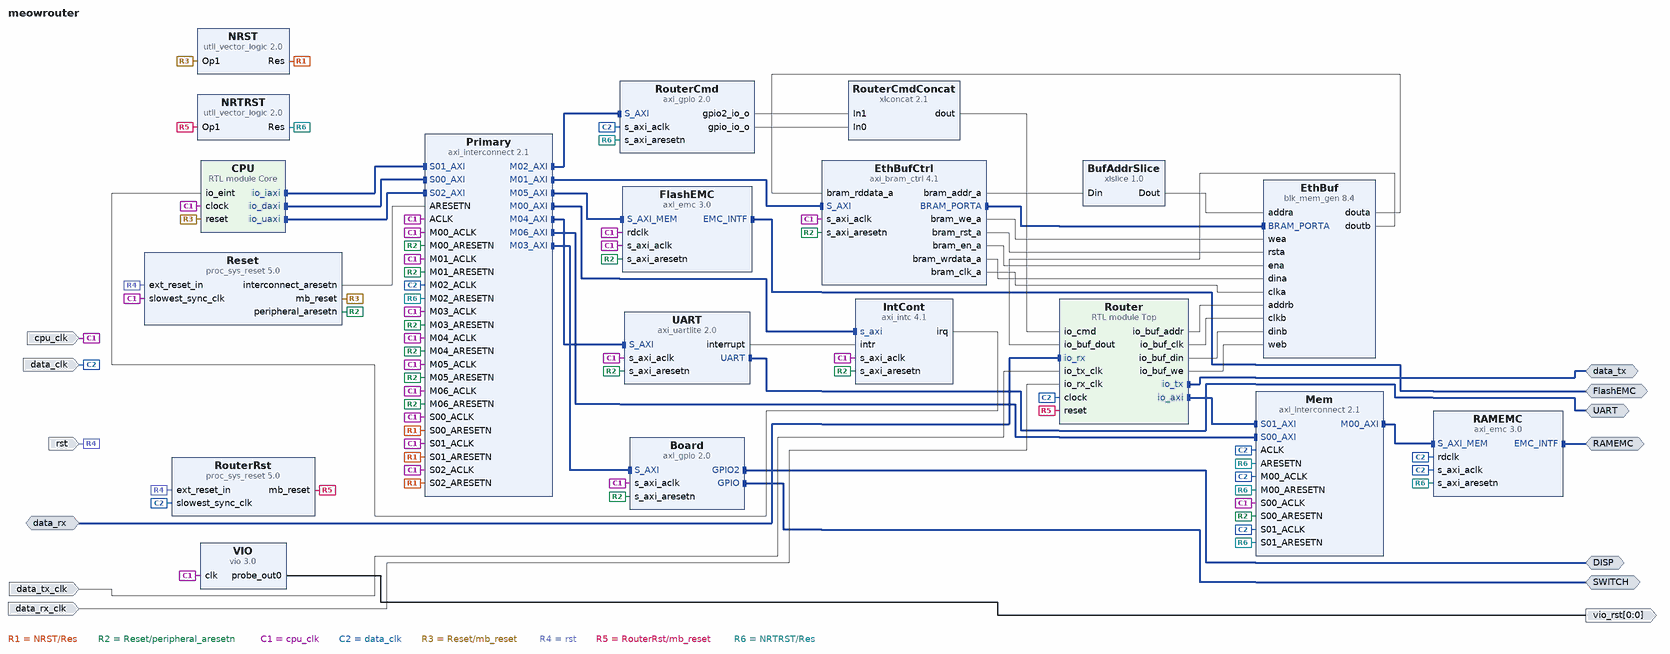
[diagram p0: block diagram of the top level]
# Vivado block design meowrouter, xc7a100tfgg676-2L, Vivado 2018.3_AR71898
create_bd_design meowrouter

create_bd_intf_port -mode Master -vlnv xilinx.com:interface:uart_rtl:1.0 UART
create_bd_intf_port -mode Slave -vlnv xilinx.com:interface:axis_rtl:1.0 data_rx
set_property -dict [list \
  CONFIG.FREQ_HZ 125000000 \
  CONFIG.HAS_TKEEP 0 \
  CONFIG.HAS_TLAST 1 \
  CONFIG.HAS_TREADY 0 \
  CONFIG.HAS_TSTRB 0 \
  CONFIG.LAYERED_METADATA undef \
  CONFIG.TDATA_NUM_BYTES 1 \
  CONFIG.TDEST_WIDTH 0 \
  CONFIG.TID_WIDTH 0 \
  CONFIG.TUSER_WIDTH 0 \
] [get_bd_intf_ports data_rx]
create_bd_intf_port -mode Master -vlnv xilinx.com:interface:axis_rtl:1.0 data_tx
set_property -dict {CONFIG.FREQ_HZ 125000000} [get_bd_intf_ports data_tx]
create_bd_intf_port -mode Master -vlnv xilinx.com:interface:gpio_rtl:1.0 DISP
create_bd_intf_port -mode Master -vlnv xilinx.com:interface:gpio_rtl:1.0 SWITCH
create_bd_intf_port -mode Master -vlnv xilinx.com:interface:emc_rtl:1.0 RAMEMC
create_bd_intf_port -mode Master -vlnv xilinx.com:interface:emc_rtl:1.0 FlashEMC
create_bd_port -dir I -type clk cpu_clk
set_property -dict {CONFIG.FREQ_HZ 70000000} [get_bd_ports cpu_clk]
create_bd_port -dir I -type rst rst
set_property -dict {CONFIG.POLARITY ACTIVE_HIGH} [get_bd_ports rst]
create_bd_port -dir I -type clk data_clk
set_property -dict {CONFIG.FREQ_HZ 125000000} [get_bd_ports data_clk]
create_bd_port -dir I -type clk data_rx_clk
set_property -dict {CONFIG.FREQ_HZ 125000000} [get_bd_ports data_rx_clk]
create_bd_port -dir I -type clk data_tx_clk
set_property -dict {CONFIG.FREQ_HZ 125000000} [get_bd_ports data_tx_clk]
create_bd_port -dir O -from 0 -to 0 vio_rst

create_bd_cell -type ip -vlnv xilinx.com:ip:blk_mem_gen:8.4 EthBuf
set_property -dict [list \
  CONFIG.Assume_Synchronous_Clk false \
  CONFIG.Byte_Size 8 \
  CONFIG.EN_SAFETY_CKT true \
  CONFIG.Enable_32bit_Address false \
  CONFIG.Enable_B Always_Enabled \
  CONFIG.Memory_Type True_Dual_Port_RAM \
  CONFIG.Port_B_Clock 100 \
  CONFIG.Port_B_Enable_Rate 100 \
  CONFIG.Port_B_Write_Rate 50 \
  CONFIG.Read_Width_A 32 \
  CONFIG.Read_Width_B 8 \
  CONFIG.Register_PortA_Output_of_Memory_Core false \
  CONFIG.Register_PortA_Output_of_Memory_Primitives false \
  CONFIG.Register_PortB_Output_of_Memory_Core false \
  CONFIG.Register_PortB_Output_of_Memory_Primitives false \
  CONFIG.Use_Byte_Write_Enable true \
  CONFIG.Use_RSTA_Pin true \
  CONFIG.Use_RSTB_Pin false \
  CONFIG.Write_Depth_A 32768 \
  CONFIG.Write_Width_A 32 \
  CONFIG.Write_Width_B 8 \
  CONFIG.use_bram_block Stand_Alone \
] [get_bd_cells EthBuf]
create_bd_cell -type ip -vlnv xilinx.com:ip:axi_bram_ctrl:4.1 EthBufCtrl
set_property -dict [list \
  CONFIG.DATA_WIDTH 32 \
  CONFIG.PROTOCOL AXI4 \
  CONFIG.READ_LATENCY 1 \
  CONFIG.SINGLE_PORT_BRAM 1 \
] [get_bd_cells EthBufCtrl]
create_bd_cell -type ip -vlnv xilinx.com:ip:util_vector_logic:2.0 NRST
set_property -dict {CONFIG.C_OPERATION not CONFIG.C_SIZE 1} [get_bd_cells NRST]
create_bd_cell -type ip -vlnv xilinx.com:ip:proc_sys_reset:5.0 Reset
create_bd_cell -type ip -vlnv xilinx.com:ip:axi_gpio:2.0 Board
set_property -dict [list \
  CONFIG.C_ALL_INPUTS 1 \
  CONFIG.C_ALL_OUTPUTS_2 1 \
  CONFIG.C_GPIO2_WIDTH 32 \
  CONFIG.C_GPIO_WIDTH 16 \
  CONFIG.C_IS_DUAL 1 \
] [get_bd_cells Board]
create_bd_cell -type ip -vlnv xilinx.com:ip:axi_emc:3.0 RAMEMC
set_property -dict [list \
  CONFIG.C_INCLUDE_DATAWIDTH_MATCHING_0 0 \
  CONFIG.C_MAX_MEM_WIDTH 64 \
  CONFIG.C_MEM0_TYPE 1 \
  CONFIG.C_MEM0_WIDTH 64 \
  CONFIG.C_MEM1_WIDTH 16 \
  CONFIG.C_NUM_BANKS_MEM 1 \
  CONFIG.C_S_AXI_MEM_DATA_WIDTH 64 \
  CONFIG.C_TAVDV_PS_MEM_0 10000 \
  CONFIG.C_TCEDV_PS_MEM_0 10000 \
  CONFIG.C_THZCE_PS_MEM_0 10000 \
  CONFIG.C_THZOE_PS_MEM_0 6500 \
] [get_bd_cells RAMEMC]
create_bd_cell -type ip -vlnv xilinx.com:ip:axi_emc:3.0 FlashEMC
set_property -dict [list \
  CONFIG.C_MEM0_TYPE 5 \
  CONFIG.C_TAVDV_PS_MEM_0 30000 \
  CONFIG.C_TCEDV_PS_MEM_0 70000 \
  CONFIG.C_THZCE_PS_MEM_0 7000 \
] [get_bd_cells FlashEMC]
create_bd_cell -type ip -vlnv xilinx.com:ip:vio:3.0 VIO
set_property -dict {CONFIG.C_NUM_PROBE_IN 0 CONFIG.C_NUM_PROBE_OUT 1} [get_bd_cells VIO]
create_bd_cell -type ip -vlnv xilinx.com:ip:axi_intc:4.1 IntCont
set_property -dict [list \
  CONFIG.C_CASCADE_MASTER 0 \
  CONFIG.C_EN_CASCADE_MODE 0 \
  CONFIG.C_HAS_CIE 1 \
  CONFIG.C_HAS_ILR 0 \
  CONFIG.C_HAS_IPR 1 \
  CONFIG.C_HAS_IVR 1 \
  CONFIG.C_HAS_SIE 1 \
  CONFIG.C_IRQ_CONNECTION 1 \
  CONFIG.C_IRQ_IS_LEVEL 1 \
  CONFIG.C_NUM_SW_INTR 0 \
  CONFIG.C_PROCESSOR_CLK_FREQ_MHZ 70 \
  CONFIG.C_S_AXI_ACLK_FREQ_MHZ 70 \
  CONFIG.Sense_of_IRQ_Level_Type Active_High \
] [get_bd_cells IntCont]
create_bd_cell -type ip -vlnv xilinx.com:ip:xlslice:1.0 BufAddrSlice
set_property -dict {CONFIG.DIN_FROM 31 CONFIG.DIN_TO 2 CONFIG.DOUT_WIDTH 30} [get_bd_cells BufAddrSlice]
create_bd_cell -type ip -vlnv xilinx.com:ip:axi_uartlite:2.0 UART
set_property -dict [list \
  CONFIG.C_BAUDRATE 57600 \
  CONFIG.C_S_AXI_ACLK_FREQ_HZ 70000000 \
  CONFIG.C_S_AXI_ACLK_FREQ_HZ_d 70 \
] [get_bd_cells UART]
create_bd_cell -type ip -vlnv xilinx.com:ip:axi_gpio:2.0 RouterCmd
set_property -dict [list \
  CONFIG.C_ALL_OUTPUTS 1 \
  CONFIG.C_ALL_OUTPUTS_2 1 \
  CONFIG.C_GPIO_WIDTH 32 \
  CONFIG.C_INTERRUPT_PRESENT 0 \
  CONFIG.C_IS_DUAL 1 \
] [get_bd_cells RouterCmd]
create_bd_cell -type ip -vlnv xilinx.com:ip:xlconcat:2.1 RouterCmdConcat
create_bd_cell -type module -reference Core CPU
create_bd_cell -type ip -vlnv xilinx.com:ip:proc_sys_reset:5.0 RouterRst
create_bd_cell -type ip -vlnv xilinx.com:ip:util_vector_logic:2.0 NRTRST
set_property -dict {CONFIG.C_OPERATION not CONFIG.C_SIZE 1} [get_bd_cells NRTRST]
create_bd_cell -type ip -vlnv xilinx.com:ip:axi_interconnect:2.1 Primary
set_property -dict [list \
  CONFIG.ENABLE_ADVANCED_OPTIONS 0 \
  CONFIG.NUM_MI 7 \
  CONFIG.NUM_SI 3 \
  CONFIG.S00_HAS_DATA_FIFO 2 \
  CONFIG.S01_HAS_DATA_FIFO 2 \
  CONFIG.S02_HAS_DATA_FIFO 2 \
  CONFIG.S03_HAS_DATA_FIFO 2 \
  CONFIG.STRATEGY 2 \
] [get_bd_cells Primary]
create_bd_cell -type ip -vlnv xilinx.com:ip:axi_interconnect:2.1 Mem
set_property -dict [list \
  CONFIG.NUM_MI 1 \
  CONFIG.NUM_SI 2 \
  CONFIG.S00_HAS_DATA_FIFO 2 \
  CONFIG.S01_HAS_DATA_FIFO 2 \
  CONFIG.STRATEGY 2 \
] [get_bd_cells Mem]
create_bd_cell -type module -reference Top Router

# ---- connections ----

connect_bd_intf_net [get_bd_intf_ports FlashEMC] [get_bd_intf_pins FlashEMC/EMC_INTF]
connect_bd_intf_net -intf_net axi_gpio_0_GPIO2 [get_bd_intf_ports DISP] [get_bd_intf_pins Board/GPIO2]
connect_bd_intf_net -intf_net axi_interconnect_0_M01_AXI [get_bd_intf_pins Primary/M01_AXI] [get_bd_intf_pins EthBufCtrl/S_AXI]
connect_bd_intf_net -intf_net axi_interconnect_0_M02_AXI [get_bd_intf_pins Primary/M02_AXI] [get_bd_intf_pins RouterCmd/S_AXI]
connect_bd_intf_net -intf_net axi_interconnect_0_M00_AXI1 [get_bd_intf_pins RAMEMC/S_AXI_MEM] [get_bd_intf_pins Mem/M00_AXI]
connect_bd_intf_net [get_bd_intf_pins Primary/S01_AXI] [get_bd_intf_pins CPU/io_iaxi]
connect_bd_intf_net [get_bd_intf_pins EthBufCtrl/BRAM_PORTA] [get_bd_intf_pins EthBuf/BRAM_PORTA]
connect_bd_intf_net -intf_net axi_uartlite_0_UART [get_bd_intf_ports UART] [get_bd_intf_pins UART/UART]
connect_bd_intf_net [get_bd_intf_ports data_tx] [get_bd_intf_pins Router/io_tx]
connect_bd_intf_net [get_bd_intf_ports data_rx] [get_bd_intf_pins Router/io_rx]
connect_bd_intf_net [get_bd_intf_ports RAMEMC] [get_bd_intf_pins RAMEMC/EMC_INTF]
connect_bd_intf_net [get_bd_intf_ports SWITCH] [get_bd_intf_pins Board/GPIO]
connect_bd_intf_net -intf_net axi_interconnect_0_M04_AXI [get_bd_intf_pins Primary/M04_AXI] [get_bd_intf_pins UART/S_AXI]
connect_bd_intf_net -intf_net axi_interconnect_0_M00_AXI [get_bd_intf_pins Primary/M00_AXI] [get_bd_intf_pins IntCont/s_axi]
connect_bd_intf_net [get_bd_intf_pins Primary/S00_AXI] [get_bd_intf_pins CPU/io_daxi]
connect_bd_intf_net [get_bd_intf_pins Mem/S00_AXI] [get_bd_intf_pins Primary/M06_AXI]
connect_bd_intf_net -intf_net axi_interconnect_0_M03_AXI [get_bd_intf_pins Primary/M03_AXI] [get_bd_intf_pins Board/S_AXI]
connect_bd_intf_net [get_bd_intf_pins Router/io_axi] [get_bd_intf_pins Mem/S01_AXI]
connect_bd_intf_net -intf_net axi_interconnect_0_M05_AXI [get_bd_intf_pins Primary/M05_AXI] [get_bd_intf_pins FlashEMC/S_AXI_MEM]
connect_bd_intf_net [get_bd_intf_pins Primary/S02_AXI] [get_bd_intf_pins CPU/io_uaxi]
connect_bd_net -net util_vector_logic_0_Res [get_bd_pins NRST/Res] \
  [get_bd_pins Primary/S00_ARESETN] [get_bd_pins Primary/S01_ARESETN] [get_bd_pins Primary/S02_ARESETN]
connect_bd_net -net proc_sys_reset_0_peripheral_aresetn [get_bd_pins Reset/peripheral_aresetn] \
  [get_bd_pins Board/s_axi_aresetn] [get_bd_pins EthBufCtrl/s_axi_aresetn] [get_bd_pins FlashEMC/s_axi_aresetn] \
  [get_bd_pins IntCont/s_axi_aresetn] [get_bd_pins UART/s_axi_aresetn] [get_bd_pins Primary/M00_ARESETN] \
  [get_bd_pins Primary/M03_ARESETN] [get_bd_pins Primary/M04_ARESETN] [get_bd_pins Primary/M05_ARESETN] \
  [get_bd_pins Primary/M01_ARESETN] [get_bd_pins Primary/M06_ARESETN] [get_bd_pins Mem/S00_ARESETN]
connect_bd_net -net clk_1 [get_bd_ports cpu_clk] \
  [get_bd_pins Reset/slowest_sync_clk] [get_bd_pins EthBufCtrl/s_axi_aclk] [get_bd_pins Board/s_axi_aclk] \
  [get_bd_pins FlashEMC/s_axi_aclk] [get_bd_pins FlashEMC/rdclk] [get_bd_pins VIO/clk] [get_bd_pins IntCont/s_axi_aclk] \
  [get_bd_pins UART/s_axi_aclk] [get_bd_pins CPU/clock] [get_bd_pins Primary/M05_ACLK] [get_bd_pins Primary/M04_ACLK] \
  [get_bd_pins Primary/M03_ACLK] [get_bd_pins Primary/M01_ACLK] [get_bd_pins Primary/M00_ACLK] [get_bd_pins Primary/S00_ACLK] \
  [get_bd_pins Primary/S01_ACLK] [get_bd_pins Primary/S02_ACLK] [get_bd_pins Primary/ACLK] [get_bd_pins Primary/M06_ACLK] \
  [get_bd_pins Mem/S00_ACLK]
connect_bd_net -net vio_0_probe_out0 [get_bd_pins VIO/probe_out0] [get_bd_ports vio_rst]
connect_bd_net -net tx_clk_1 [get_bd_ports data_tx_clk] [get_bd_pins Router/io_tx_clk]
connect_bd_net -net rx_clk_1 [get_bd_ports data_rx_clk] [get_bd_pins Router/io_rx_clk]
connect_bd_net -net rtclk_1 [get_bd_ports data_clk] \
  [get_bd_pins RouterCmd/s_axi_aclk] [get_bd_pins RouterRst/slowest_sync_clk] [get_bd_pins Primary/M02_ACLK] \
  [get_bd_pins RAMEMC/s_axi_aclk] [get_bd_pins RAMEMC/rdclk] [get_bd_pins Mem/M00_ACLK] [get_bd_pins Mem/S01_ACLK] \
  [get_bd_pins Mem/ACLK] [get_bd_pins Router/clock]
connect_bd_net -net proc_sys_reset_0_mb_reset [get_bd_pins Reset/mb_reset] [get_bd_pins NRST/Op1] [get_bd_pins CPU/reset]
connect_bd_net -net axi_intc_0_irq [get_bd_pins IntCont/irq] [get_bd_pins CPU/io_eint]
connect_bd_net [get_bd_pins Router/io_buf_addr] [get_bd_pins EthBuf/addrb]
connect_bd_net [get_bd_pins Router/io_buf_clk] [get_bd_pins EthBuf/clkb]
connect_bd_net [get_bd_pins Router/io_buf_din] [get_bd_pins EthBuf/dinb]
connect_bd_net [get_bd_pins EthBuf/doutb] [get_bd_pins Router/io_buf_dout]
connect_bd_net [get_bd_pins Router/io_buf_we] [get_bd_pins EthBuf/web]
connect_bd_net [get_bd_pins EthBufCtrl/bram_addr_a] [get_bd_pins BufAddrSlice/Din]
connect_bd_net -net xlslice_0_Dout [get_bd_pins BufAddrSlice/Dout] [get_bd_pins EthBuf/addra]
connect_bd_net [get_bd_pins EthBufCtrl/bram_we_a] [get_bd_pins EthBuf/wea]
connect_bd_net [get_bd_pins EthBufCtrl/bram_rst_a] [get_bd_pins EthBuf/rsta]
connect_bd_net [get_bd_pins EthBufCtrl/bram_en_a] [get_bd_pins EthBuf/ena]
connect_bd_net [get_bd_pins EthBuf/douta] [get_bd_pins EthBufCtrl/bram_rddata_a]
connect_bd_net [get_bd_pins EthBufCtrl/bram_wrdata_a] [get_bd_pins EthBuf/dina]
connect_bd_net [get_bd_pins EthBufCtrl/bram_clk_a] [get_bd_pins EthBuf/clka]
connect_bd_net -net axi_uartlite_0_interrupt [get_bd_pins UART/interrupt] [get_bd_pins IntCont/intr]
connect_bd_net -net xlconcat_0_dout [get_bd_pins RouterCmdConcat/dout] [get_bd_pins Router/io_cmd]
connect_bd_net [get_bd_pins RouterCmd/gpio2_io_o] [get_bd_pins RouterCmdConcat/In1]
connect_bd_net [get_bd_pins RouterCmd/gpio_io_o] [get_bd_pins RouterCmdConcat/In0]
connect_bd_net [get_bd_ports rst] [get_bd_pins Reset/ext_reset_in] [get_bd_pins RouterRst/ext_reset_in]
connect_bd_net [get_bd_pins RouterRst/mb_reset] [get_bd_pins NRTRST/Op1] [get_bd_pins Router/reset]
connect_bd_net -net S03_ARESETN_1 [get_bd_pins NRTRST/Res] \
  [get_bd_pins RouterCmd/s_axi_aresetn] [get_bd_pins Primary/M02_ARESETN] [get_bd_pins RAMEMC/s_axi_aresetn] \
  [get_bd_pins Mem/M00_ARESETN] [get_bd_pins Mem/S01_ARESETN] [get_bd_pins Mem/ARESETN]
connect_bd_net -net ARESETN_1 [get_bd_pins Reset/interconnect_aresetn] [get_bd_pins Primary/ARESETN]

# ---- address map ----
assign_bd_address -offset 0x000000000000 -range 8M -target_address_space [get_bd_addr_spaces CPU/io_daxi] [get_bd_addr_segs RAMEMC/S_AXI_MEM/Mem0]
assign_bd_address -offset 0xF00000000000 -range 64K -target_address_space [get_bd_addr_spaces CPU/io_daxi] [get_bd_addr_segs IntCont/S_AXI/Reg]
assign_bd_address -offset 0xFFFF00000000 -range 1M -target_address_space [get_bd_addr_spaces CPU/io_daxi] [get_bd_addr_segs UART/S_AXI/Reg]
assign_bd_address -offset 0xFFFF10000000 -range 1M -target_address_space [get_bd_addr_spaces CPU/io_daxi] [get_bd_addr_segs Board/S_AXI/Reg]
assign_bd_address -offset 0xFFFF20000000 -range 8M -target_address_space [get_bd_addr_spaces CPU/io_daxi] [get_bd_addr_segs FlashEMC/S_AXI_MEM/Mem0]
assign_bd_address -offset 0xFFFF30000000 -range 1M -target_address_space [get_bd_addr_spaces CPU/io_daxi] [get_bd_addr_segs EthBufCtrl/S_AXI/Mem0]
assign_bd_address -offset 0xFFFF40000000 -range 1M -target_address_space [get_bd_addr_spaces CPU/io_daxi] [get_bd_addr_segs RouterCmd/S_AXI/Reg]
assign_bd_address -offset 0x000000000000 -range 8M -target_address_space [get_bd_addr_spaces CPU/io_iaxi] [get_bd_addr_segs RAMEMC/S_AXI_MEM/Mem0]
assign_bd_address -offset 0xF00000000000 -range 64K -target_address_space [get_bd_addr_spaces CPU/io_iaxi] [get_bd_addr_segs IntCont/S_AXI/Reg]
assign_bd_address -offset 0xFFFF00000000 -range 1M -target_address_space [get_bd_addr_spaces CPU/io_iaxi] [get_bd_addr_segs UART/S_AXI/Reg]
assign_bd_address -offset 0xFFFF10000000 -range 1M -target_address_space [get_bd_addr_spaces CPU/io_iaxi] [get_bd_addr_segs Board/S_AXI/Reg]
assign_bd_address -offset 0xFFFF20000000 -range 8M -target_address_space [get_bd_addr_spaces CPU/io_iaxi] [get_bd_addr_segs FlashEMC/S_AXI_MEM/Mem0]
assign_bd_address -offset 0xFFFF30000000 -range 1M -target_address_space [get_bd_addr_spaces CPU/io_iaxi] [get_bd_addr_segs EthBufCtrl/S_AXI/Mem0]
assign_bd_address -offset 0xFFFF40000000 -range 1M -target_address_space [get_bd_addr_spaces CPU/io_iaxi] [get_bd_addr_segs RouterCmd/S_AXI/Reg]
assign_bd_address -offset 0x000000000000 -range 8M -target_address_space [get_bd_addr_spaces CPU/io_uaxi] [get_bd_addr_segs RAMEMC/S_AXI_MEM/Mem0]
assign_bd_address -offset 0xF00000000000 -range 64K -target_address_space [get_bd_addr_spaces CPU/io_uaxi] [get_bd_addr_segs IntCont/S_AXI/Reg]
assign_bd_address -offset 0xFFFF00000000 -range 1M -target_address_space [get_bd_addr_spaces CPU/io_uaxi] [get_bd_addr_segs UART/S_AXI/Reg]
assign_bd_address -offset 0xFFFF10000000 -range 1M -target_address_space [get_bd_addr_spaces CPU/io_uaxi] [get_bd_addr_segs Board/S_AXI/Reg]
assign_bd_address -offset 0xFFFF20000000 -range 8M -target_address_space [get_bd_addr_spaces CPU/io_uaxi] [get_bd_addr_segs FlashEMC/S_AXI_MEM/Mem0]
assign_bd_address -offset 0xFFFF30000000 -range 1M -target_address_space [get_bd_addr_spaces CPU/io_uaxi] [get_bd_addr_segs EthBufCtrl/S_AXI/Mem0]
assign_bd_address -offset 0xFFFF40000000 -range 1M -target_address_space [get_bd_addr_spaces CPU/io_uaxi] [get_bd_addr_segs RouterCmd/S_AXI/Reg]
assign_bd_address -offset 0x000000000000 -range 8M -target_address_space [get_bd_addr_spaces Router/io_axi] [get_bd_addr_segs RAMEMC/S_AXI_MEM/Mem0]
exclude_bd_addr_seg -offset 0xF00000000000 -range 64K -target_address_space [get_bd_addr_spaces Router/io_axi] [get_bd_addr_segs IntCont/S_AXI/Reg]
exclude_bd_addr_seg -offset 0xFFFF00000000 -range 1M -target_address_space [get_bd_addr_spaces Router/io_axi] [get_bd_addr_segs UART/S_AXI/Reg]
exclude_bd_addr_seg -offset 0xFFFF10000000 -range 1M -target_address_space [get_bd_addr_spaces Router/io_axi] [get_bd_addr_segs Board/S_AXI/Reg]
exclude_bd_addr_seg -offset 0xFFFF20000000 -range 8M -target_address_space [get_bd_addr_spaces Router/io_axi] [get_bd_addr_segs FlashEMC/S_AXI_MEM/Mem0]
exclude_bd_addr_seg -offset 0xFFFF30000000 -range 16K -target_address_space [get_bd_addr_spaces Router/io_axi] [get_bd_addr_segs EthBufCtrl/S_AXI/Mem0]
exclude_bd_addr_seg -offset 0xFFFF40000000 -range 1M -target_address_space [get_bd_addr_spaces Router/io_axi] [get_bd_addr_segs RouterCmd/S_AXI/Reg]

validate_bd_design
save_bd_design
